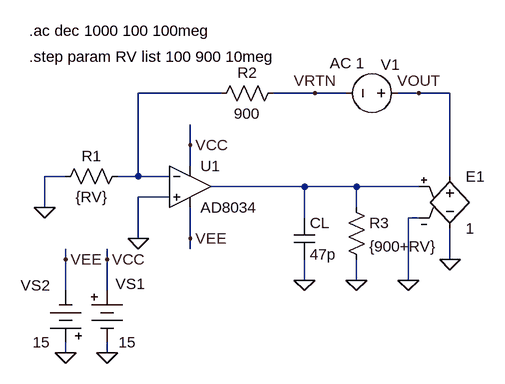
[diagram p0: schematic fig-03-01-22.asc]
fig-03-01-22.asc, the LTspice schematic file:
Version 4
SHEET 1 880 680
WIRE 256 32 128 32
WIRE 400 32 336 32
WIRE 448 32 400 32
WIRE 560 32 528 32
WIRE 608 32 560 32
WIRE 208 112 208 80
WIRE 208 144 208 112
WIRE 16 160 -16 160
WIRE 128 160 128 32
WIRE 128 160 96 160
WIRE 176 160 128 160
WIRE 608 160 608 32
WIRE 384 176 240 176
WIRE 464 176 384 176
WIRE 560 176 464 176
WIRE 176 192 128 192
WIRE -16 208 -16 160
WIRE 464 208 464 176
WIRE 384 224 384 176
WIRE 560 224 544 224
WIRE 128 256 128 192
WIRE 208 256 208 208
WIRE 208 272 208 256
WIRE 16 288 16 272
WIRE 80 288 80 272
WIRE 608 288 608 240
WIRE 384 320 384 288
WIRE 464 320 464 288
WIRE 544 320 544 224
WIRE 16 336 16 288
WIRE 80 336 80 288
WIRE 16 432 16 416
WIRE 80 432 80 416
FLAG 128 256 0
FLAG -16 208 0
FLAG 16 432 0
FLAG 80 432 0
FLAG 16 288 VEE
FLAG 80 288 VCC
FLAG 208 112 VCC
FLAG 208 256 VEE
FLAG 384 320 0
FLAG 560 32 VOUT
FLAG 400 32 VRTN
FLAG 464 320 0
FLAG 608 288 0
FLAG 544 320 0
SYMBOL res 352 16 R90
WINDOW 0 0 56 VBottom 2
WINDOW 3 32 56 VTop 2
SYMATTR InstName R2
SYMATTR Value 900
SYMBOL Misc\\battery 80 320 R0
WINDOW 0 13 6 Left 2
WINDOW 3 18 96 Left 2
SYMATTR InstName VS1
SYMATTR Value 15
SYMBOL Misc\\battery 16 432 R180
WINDOW 0 24 104 Left 2
WINDOW 3 24 16 Left 2
SYMATTR InstName VS2
SYMATTR Value 15
SYMBOL res 112 144 R90
WINDOW 0 0 56 VBottom 2
WINDOW 3 32 56 VTop 2
SYMATTR InstName R1
SYMATTR Value {RV}
SYMBOL voltage 544 32 M270
WINDOW 3 -77 115 Left 2
WINDOW 123 46 68 VRight 2
WINDOW 39 0 0 Left 0
WINDOW 0 44 13 VRight 2
SYMATTR Value ""
SYMATTR Value2 AC 1
SYMATTR InstName V1
SYMBOL cap 368 224 R0
SYMATTR InstName CL
SYMATTR Value 47p
SYMBOL Opamps\\AD8034 208 112 R0
SYMATTR InstName U1
SYMBOL e 608 144 R0
SYMATTR InstName E1
SYMATTR Value 1
SYMBOL res 448 192 R0
SYMATTR InstName R3
SYMATTR Value {900+RV}
TEXT -40 -64 Left 2 !.ac dec 1000 100 100meg
TEXT -40 -24 Left 2 !.step param RV list 100 900 10meg

The netlist it stands for:
* fig-03-01-22.asc
R2 VRTN N001 900
VS1 VCC 0 15
VS2 0 VEE 15
R1 N001 0 {RV}
V1 VOUT VRTN AC 1
CL N002 0 47p
XU1 0 N001 VCC VEE N002 AD8034  ; pins In+ In- V+ V- OUT
E1 VOUT 0 N002 0 1
R3 N002 0 {900+RV}
.ac dec 1000 100 100meg
.step param RV list 100 900 10meg
.backanno
.end